# Altium schematic sheet Storage.SchDoc
size A4; SheetNumber: 6; SheetTotal: 7; SPICEModelCacheNPRVAKVK: <root> / <DocumentId>NPRVAKVK</DocumentId> / </root>
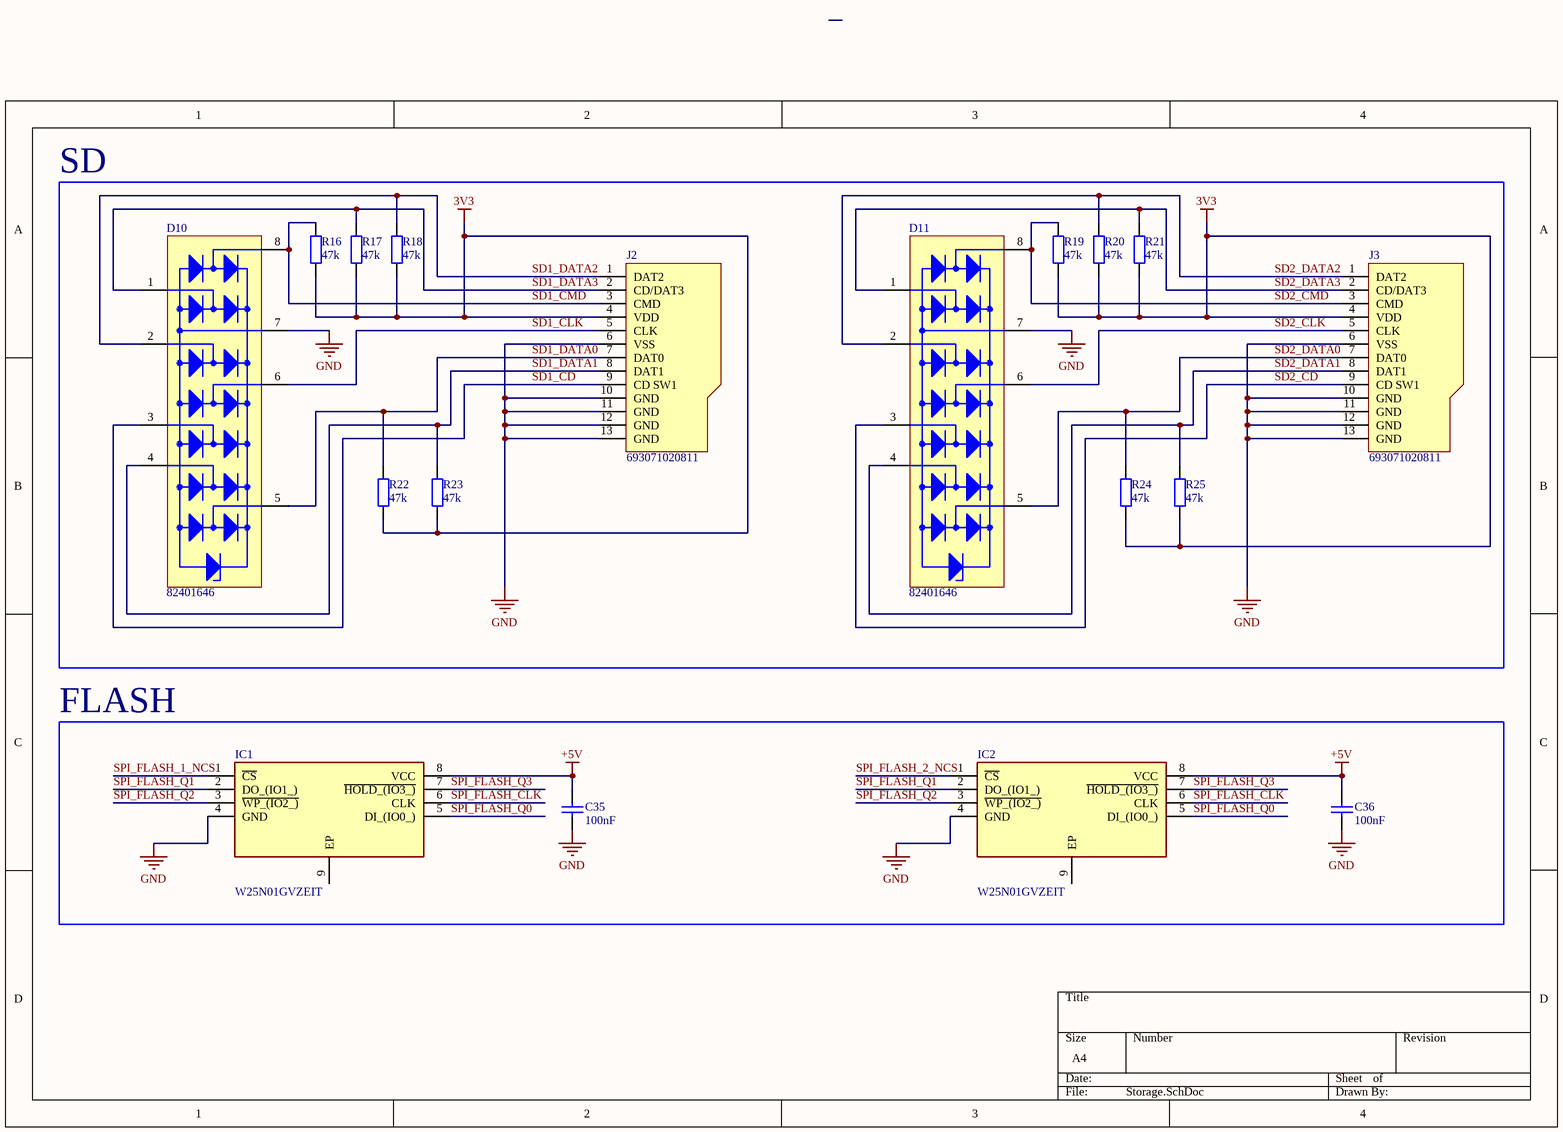
[diagram p0: Storage.SchDoc]

## Parts
C35  value 100nF  [WCAP-CSGP_0603_L1.6W0.8H0.8_Reflow]  (hidden comment: 885012206071)
C36  value 100nF  [WCAP-CSGP_0603_L1.6W0.8H0.8_Reflow]  (hidden comment: 885012206071)
D10  82401646  [WE-TVS_MSOP-8L]
D11  82401646  [WE-TVS_MSOP-8L]
IC1  W25N01GVZEIT  [SON127P800X600X80-9N-D]
IC2  W25N01GVZEIT  [SON127P800X600X80-9N-D]
J2  693071020811  [693071020811]
J3  693071020811  [693071020811]
R16  value 47k  [WRIS-RSKS_0603_Reflow]  (hidden comment: 560112116025)
R17  value 47k  [WRIS-RSKS_0603_Reflow]  (hidden comment: 560112116025)
R18  value 47k  [WRIS-RSKS_0603_Reflow]  (hidden comment: 560112116025)
R19  value 47k  [WRIS-RSKS_0603_Reflow]  (hidden comment: 560112116025)
R20  value 47k  [WRIS-RSKS_0603_Reflow]  (hidden comment: 560112116025)
R21  value 47k  [WRIS-RSKS_0603_Reflow]  (hidden comment: 560112116025)
R22  value 47k  [WRIS-RSKS_0603_Reflow]  (hidden comment: 560112116025)
R23  value 47k  [WRIS-RSKS_0603_Reflow]  (hidden comment: 560112116025)
R24  value 47k  [WRIS-RSKS_0603_Reflow]  (hidden comment: 560112116025)
R25  value 47k  [WRIS-RSKS_0603_Reflow]  (hidden comment: 560112116025)

## Blocks framed on the sheet
SD: D10 D11 J2 J3 R16-R25
FLASH: C35 C36 IC1 IC2

## Nets
3V3: J2.4(VDD) J3.4(VDD) R16.1 R17.1 R18.1 R19.1 R20.1 R21.1 R22.1 R23.1 R24.1 R25.1
+5V: C35.2 C36.2 IC1.8(VCC) IC2.8(VCC)
GND: C35.1 C36.1 D10.7(GND) D11.7(GND) IC1.4(GND) IC2.4(GND) J2.6(VSS) J2.10(GND) J2.11(GND) J2.12(GND) J2.13(GND) J3.6(VSS) J3.10(GND) J3.11(GND) J3.12(GND) J3.13(GND)
SD1_CD: D10.3(I/O_3) J2.9(CD_SW1)
SD1_CLK: D10.6(I/O_6) J2.5(CLK)
SD1_CMD: D10.8(VDD) J2.3(CMD) R16.2
SD1_DATA0: D10.5(I/O_5) J2.7(DAT0) R22.2
SD1_DATA1: D10.4(I/O_4) J2.8(DAT1) R23.2
SD1_DATA2: D10.2(I/O_2) J2.1(DAT2) R18.2
SD1_DATA3: D10.1(I/O_1) J2.2(CD/DAT3) R17.2
SD2_CD: D11.3(I/O_3) J3.9(CD_SW1)
SD2_CLK: D11.6(I/O_6) J3.5(CLK)
SD2_CMD: D11.8(VDD) J3.3(CMD) R19.2
SD2_DATA0: D11.5(I/O_5) J3.7(DAT0) R24.2
SD2_DATA1: D11.4(I/O_4) J3.8(DAT1) R25.2
SD2_DATA2: D11.2(I/O_2) J3.1(DAT2) R20.2
SD2_DATA3: D11.1(I/O_1) J3.2(CD/DAT3) R21.2
SPI_FLASH_1_NCS: IC1.1(~{CS})
SPI_FLASH_2_NCS: IC2.1(~{CS})
SPI_FLASH_CLK: IC1.6(CLK) IC2.6(CLK)
SPI_FLASH_Q0: IC1.5(DI_(IO0_)) IC2.5(DI_(IO0_))
SPI_FLASH_Q1: IC1.2(DO_(IO1_)) IC2.2(DO_(IO1_))
SPI_FLASH_Q2: IC1.3(~{WP_(IO2_)}) IC2.3(~{WP_(IO2_)})
SPI_FLASH_Q3: IC1.7(~{HOLD_(IO3_)}) IC2.7(~{HOLD_(IO3_)})

Not connected (* = marked no-connect by the designer): IC1 9(EP); IC2 9(EP)

## Library data of the parts
C35 C36 = CMP-001-00661-1: WCAP-CSGP Multilayer Ceramic Chip Capacitor, General Purpose, size 0603, X7R, 100nF, 25VDC; Manufacturer: Wurth Elektronik; Dissipation Factor: 3.5%; Capacitance Tolerance: +/-10%; Insulation Resistance: 5GOhm; Technical Reference: X7R0603104K025DFCT10000; Rated Voltage (DC): 25V; Packaging: Tape and Reel; Height: 0.8mm; Mount: Surface Mount; Source: WCAP-CSGP.SchLib; Component Type: Standard; Category: Multilayer Ceramic Chip Capacitors; Operating Temperature Min: -55°C; Case/Package: 0603; ComponentLink2Description: Datasheet Link; Width: 0.8mm; ComponentLink1URL: https://www.we-online.com/redexpert/article/885012206071?ad; Length: 1.6mm; Operating Temperature Max: 125°C; Match Code: WCAP-CSGP; ComponentLink2URL: https://www.we-online.com/redexpert/spec/885012206071?ad; Design Item ID: 885012206071; ComponentLink1Description: Website Link; Manufacturer Part Number: 885012206071; Pins: 2; Ceramic Type: X7R
D10 D11 = CMP-004-00042-1: WE-TVS TVS Diode – Super Speed Series, MSOP-8L, 6+1 Channel, 5V, 0.2pF; Manufacturer: Wurth Elektronik; (Reverse) Peak Pulse Current: 2.5A; ESD Contact Discharge Capability: 8kV; ESD Air Discharge Capability: 15kV; Polarity: Unidirectional; Channel Reverse Leakage Current: 1uA; Channel ESD Clamping Voltage: 13V; (Reverse) Breakdown Voltage: 6V; Channel Operating Voltage: 5V; ComponentLink1Description: Website Link; Number of Channels: 6+1; Source: WE-TVS.SchLib; Design Item ID: 82401646; Pins: 8; Packaging: Tape and Reel; Match Code: WE-TVS; Width: 3mm; ComponentLink2Description: Datasheet Link; Length: 4.9mm; Component Type: Standard; ComponentLink1URL: https://www.we-online.com/redexpert/article/82401646?ad; Operating Temperature Min: -55°C; ComponentLink2URL: https://www.we-online.com/redexpert/spec/82401646?ad; Mount: Surface Mount; Category: ESD Protection; Operating Temperature Max: 85°C; Manufacturer Part Number: 82401646; Case/Package: MSOP-8L; Height: 0.96mm; Channel Input Capacitance: 0.2pF
IC1 IC2 = W25N01GVZEIT: Integrated Circuit; Manufacturer_Name: Winbond; Datasheet Link: https://www.winbond.com/hq/search-resource-file.jsp?partNo=W25N01GVZEIT&type=datasheet; Height: 0.8mm; Manufacturer_Part_Number: W25N01GVZEIT; Mouser Part Number: 454-W25N01GVZEIT; Mouser Price/Stock: https://www.mouser.co.uk/ProductDetail/Winbond/W25N01GVZEIT?qs=qSfuJ%252Bfl%2Fd62yqJfJtnOQw%3D%3D; Arrow Part Number: W25N01GVZEIT; Arrow Price/Stock: https://www.arrow.com/en/products/w25n01gvzeit/winbond-electronics?region=nac
J2 J3 = CMP-002-00279-1: WR-CRD Micro SD Card Connector Push & Push; Manufacturer: Wurth Elektronik; Withstanding Voltage: 500VAC; Gender: Socket; Contact Resistance: 100mOhm; Working Voltage: 30VAC; Rated Current: 0.5A; ComponentLink2URL: https://www.we-online.com/redexpert/spec/693071020811?ad; Manufacturer Part Number: 693071020811; Pin Count: 13; Type: Push & Push; Packaging: Tape and Reel; Mount: Surface Mount; Source: WR-CRD.SchLib; Match Code: WR-CRD; ComponentLink1Description: Website Link; ComponentLink2Description: Datasheet Link; Component Type: Standard; Operating Temperature Min: -40°C; Pins: 8; ComponentLink1URL: https://www.we-online.com/redexpert/article/693071020811?ad; Operating Temperature Max: 85°C; Design Item ID: 693071020811; Category: Input/Output Connectors
R16-R25 = CMP-009-00348-1: WRIS-RSKS Thick Film Resistor, size 0603, 47000Ohm, 100mW; Manufacturer: Wurth Elektronik; Resistance Tolerance: +/-1%; Limiting Element Voltage: 75V; Temperature Coefficient of Resistance Min: -100ppm/°C; Temperature Coefficient of Resistance Max: 100ppm/°C; Height: 0.45mm; Operating Temperature Min: -55°C; Category: Thick Film Resistors; ComponentLink1URL: https://www.we-online.com/redexpert/article/560112116025?ad; Match Code: WRIS-RSKS; Case/Package: 0603; Operating Temperature Max: 155°C; Design Item ID: 560112116025; Component Type: Standard; Packaging: Tape and Reel; ComponentLink2URL: https://www.we-online.com/redexpert/spec/560112116025?ad; Pins: 2; Manufacturer Part Number: 560112116025; Width: 0.8mm; Rated Power: 100mW; Source: WRIS-RSKS.SchLib; Length: 1.6mm; ComponentLink2Description: Datasheet Link; ComponentLink1Description: Website Link; Mount: Surface Mount